# EAGLE schematic USB to UART Controler (EAGLE 8.3.2)
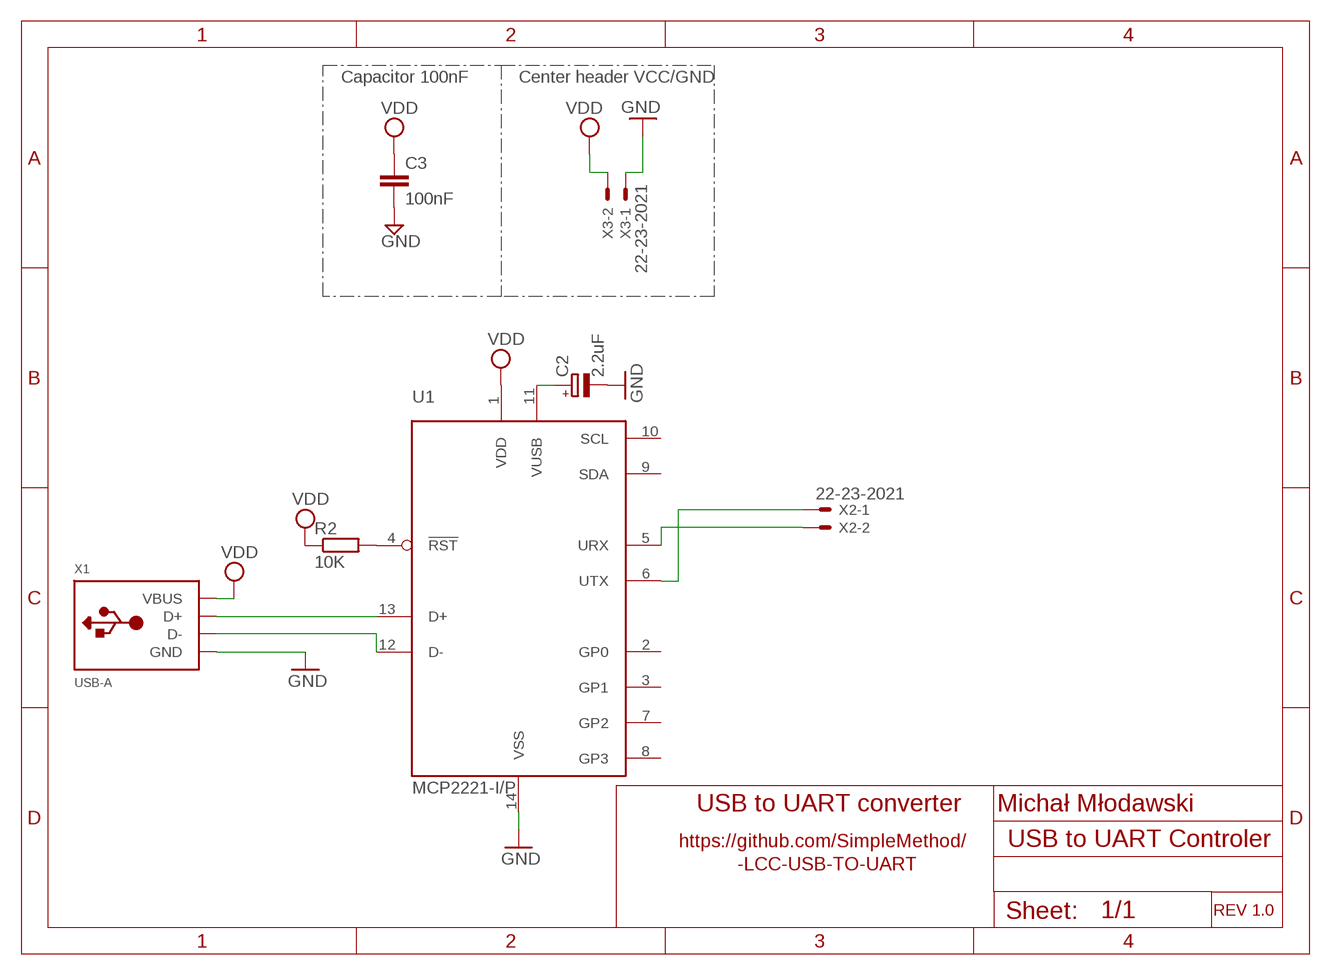
[diagram p0: schematic, sheet 1]

## Parts
C2  2.2uF  CPOL-EUTAP5-45  [TAP5-45]
C3  100nF  C2,5-3  [C2.5-3]
R2  10K  R-EU_0204/2V  [0204V]
U1  MCP2221-I/P  [DIL14]
X1  USB-A  [MOLEX_480371000]
X2  22-23-2021  [22-23-2021]
X3  22-23-2021  [22-23-2021]

## Nets
GND: C2.- C3.2 U1.14(VSS) X1.4(GND) X3.1
N$1: U1.13(D+) X1.3(D+)
N$2: U1.12(D-) X1.2(D-)
N$3: C2.+ U1.11(VUSB)
N$4: U1.5(URX) X2.2
N$5: U1.6(UTX) X2.1
N$6: R2.2 U1.4(!RST)
VDD: C3.1 R2.1 U1.1(VDD) X1.1(VBUS) X3.2
Unconnected: U1.2(GP0) U1.3(GP1) U1.7(GP2) U1.8(GP3) U1.9(SDA) U1.10(SCL)

## Notes on the sheet
- Capacitor 100nF | Center header VCC/GND
- Michał Młodawski
- USB to UART converter
- https://github.com/SimpleMethod/
- -LCC-USB-TO-UART
- REV 1.0

## Library data of the parts
C2 = rcl:CPOL-EU: POLARIZED CAPACITOR, European symbol
C3 = capacitor-wima:C: CAPACITOR naming: grid - package width
R2 = resistor:R-EU_: RESISTOR, European symbol
U1 = microchip-mcp2221:MCP2221-*: MCP2221 in PDIP, SOIC and TSSOP package The MCP2221 is a USB-to-UART/I2C serial converter which enables USB connectivity in applications that have a UART and I2C interfaces. The device reduces external components by integrating the USB termination resistors and the oscillator needed for USB operation. The MCP2221 also has four GP pins providing miscellaneous functionalities (GPIO, USBCFG, SSPND, Clock Output, ADC, DAC, interrupt detector). Source: www.microchip.com/MCP2221 <http://www.microchip.com/wwwproducts/Devices.aspx?product=MCP2221> and www.microchipdirect.com <http://www.microchipdirect.com/ProductDetails.aspx?Category=MCP2221> Tutorial: MCP2221 by Arnauld Biganzoli <https://docs.google.com/document/d/1P3zzqCKdEXzCe--1Yyg8PClCZKsUri8pyNO7AV2daaw/edit?usp=sharing>
X1 = adafruit:USB-A: USB type A 'plug' Used for things that can directly connect to a USB port, say USB key
X2 X3 = con-molex:22-23-2021: .100" (2.54mm) Center Header - 2 Pin; MF: MOLEX; MPN: 22-23-2021; OC_FARNELL: 1462926; OC_NEWARK: 25C3832